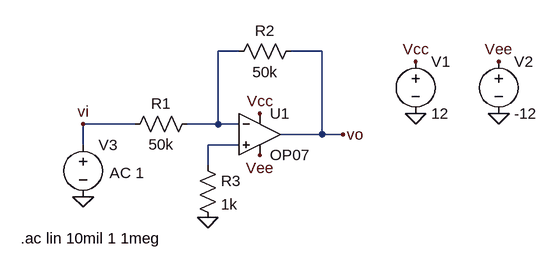
[diagram p0: schematic GBW_opamp.asc]
GBW_opamp.asc, the LTspice schematic file:
Version 4
SHEET 1 880 680
WIRE 96 32 64 32
WIRE 224 32 176 32
WIRE -64 144 -144 144
WIRE 64 144 64 32
WIRE 64 144 16 144
WIRE 96 144 64 144
WIRE 224 160 224 32
WIRE 224 160 160 160
WIRE 256 160 224 160
WIRE -144 176 -144 144
WIRE 96 176 48 176
WIRE 48 208 48 176
FLAG 368 128 0
FLAG 368 48 Vcc
FLAG 496 128 0
FLAG 496 48 Vee
FLAG 128 128 Vcc
FLAG 128 192 Vee
FLAG 256 160 vo
FLAG 48 288 0
FLAG -144 256 0
FLAG -144 144 vi
SYMBOL voltage 368 32 R0
WINDOW 123 0 0 Left 0
WINDOW 39 0 0 Left 0
SYMATTR InstName V1
SYMATTR Value 12
SYMBOL voltage 496 32 R0
WINDOW 123 0 0 Left 0
WINDOW 39 0 0 Left 0
SYMATTR InstName V2
SYMATTR Value -12
SYMBOL res 32 128 R90
WINDOW 0 0 56 VBottom 2
WINDOW 3 32 56 VTop 2
SYMATTR InstName R1
SYMATTR Value 50k
SYMBOL res 192 16 R90
WINDOW 0 0 56 VBottom 2
WINDOW 3 32 56 VTop 2
SYMATTR InstName R2
SYMATTR Value 50k
SYMBOL res 32 192 R0
SYMATTR InstName R3
SYMATTR Value 1k
SYMBOL voltage -144 160 R0
WINDOW 3 -97 138 Left 2
WINDOW 123 41 59 Left 2
WINDOW 39 0 0 Left 0
SYMATTR Value ""
SYMATTR Value2 AC 1
SYMATTR InstName V3
SYMBOL Opamps\\OP07 128 96 R0
SYMATTR InstName U1
TEXT -240 320 Left 2 !.ac lin 10mil 1 1meg

The netlist it stands for:
* GBW_opamp.asc
V1 Vcc 0 12
V2 Vee 0 -12
R1 N001 vi 50k
R2 vo N001 50k
R3 N002 0 1k
V3 vi 0 AC 1
XU1 N002 N001 Vcc Vee vo LT1001  ; OP07, pins In+ In- V+ V- OUT
.ac lin 10mil 1 1meg
.lib LTC.lib
.backanno
.end